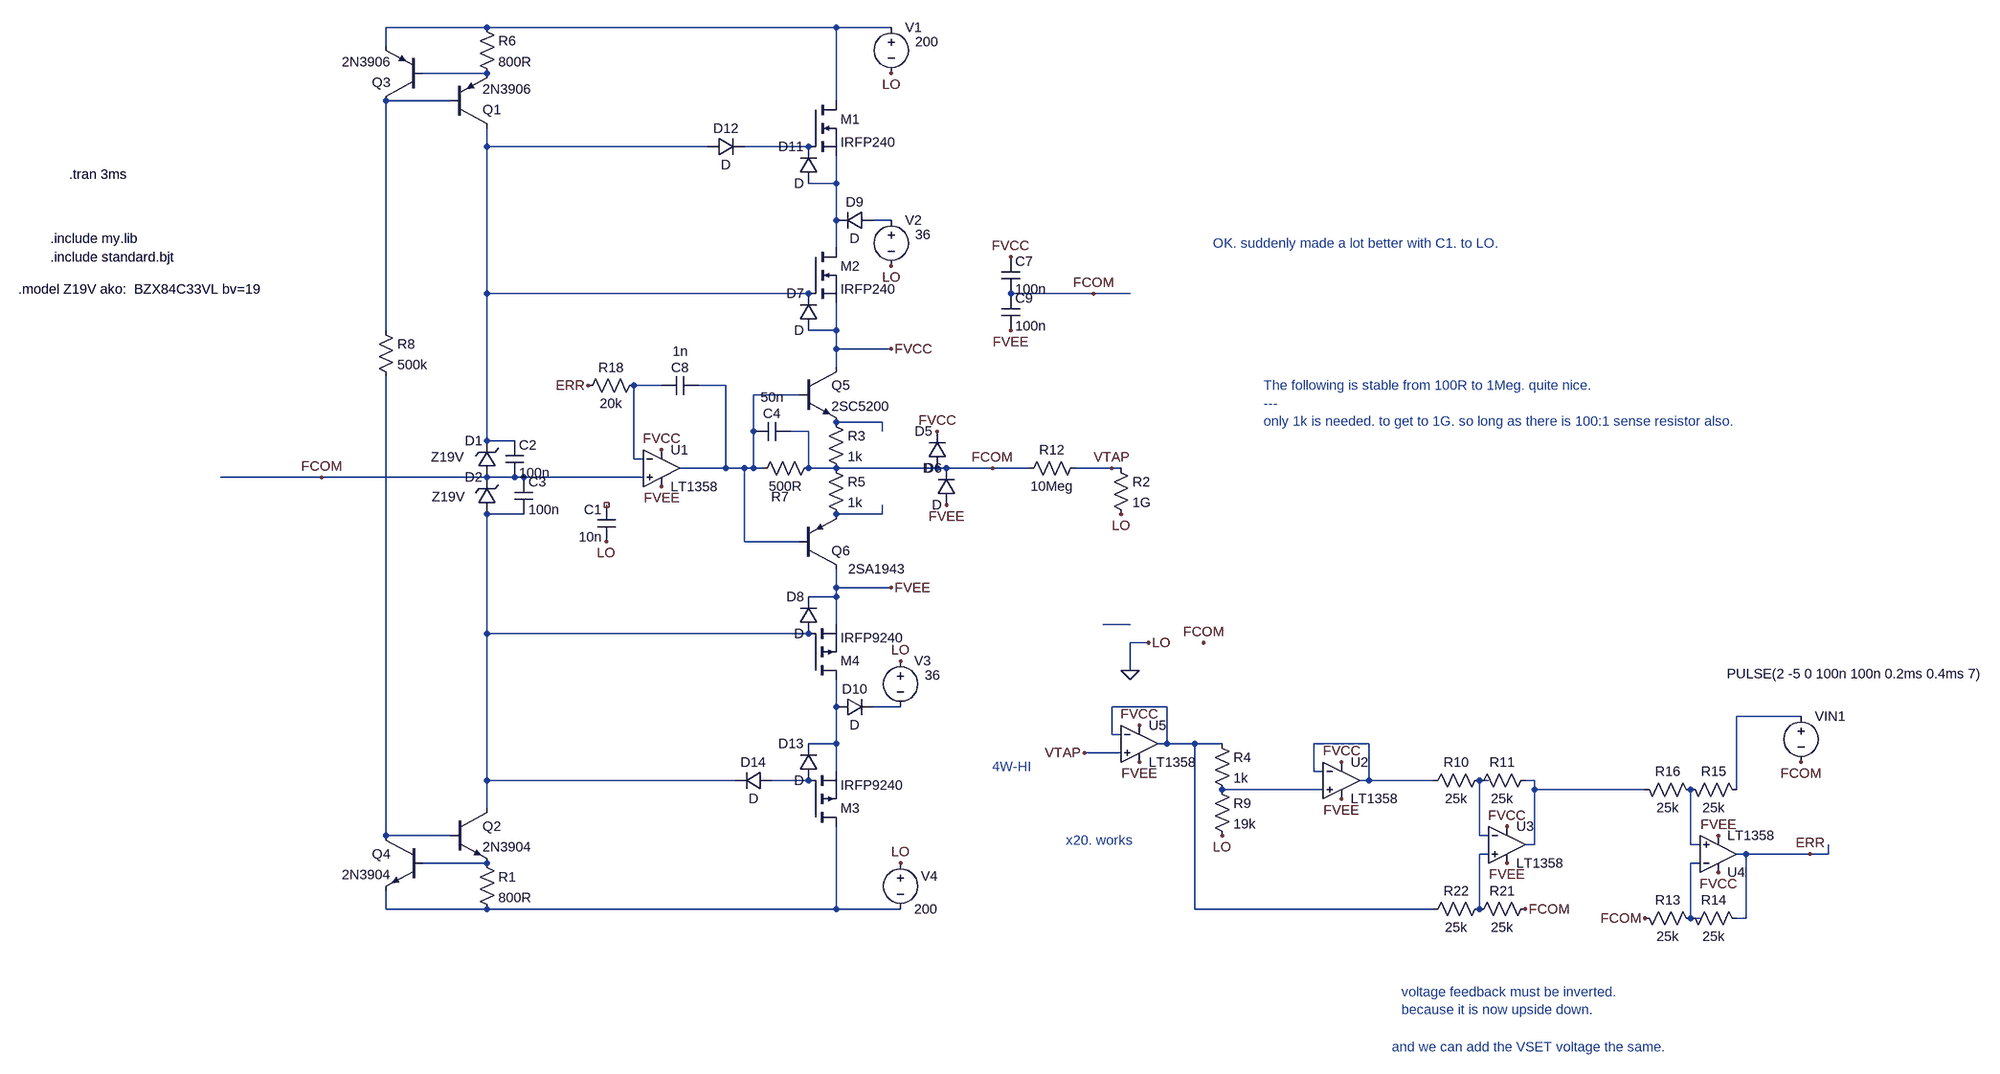
[diagram p0: schematic Draft17.asc]
Draft17.asc, the LTspice schematic file:
Version 4
SHEET 1 3524 1344
WIRE 624 -544 448 -544
WIRE 1232 -544 624 -544
WIRE 1328 -544 1232 -544
WIRE 448 -512 448 -544
WIRE 624 -464 512 -464
WIRE 560 -416 448 -416
WIRE 1232 -416 1232 -544
WIRE 624 -336 624 -368
WIRE 1008 -336 624 -336
WIRE 1184 -336 1072 -336
WIRE 1232 -272 1232 -320
WIRE 1232 -272 1184 -272
WIRE 1232 -208 1232 -272
WIRE 1328 -208 1296 -208
WIRE 1232 -160 1232 -208
WIRE 624 -80 624 -336
WIRE 1184 -80 624 -80
WIRE 1680 -80 1536 -80
WIRE 1744 -80 1680 -80
WIRE 448 -16 448 -416
WIRE 1232 -16 1232 -64
WIRE 1232 -16 1184 -16
WIRE 1232 16 1232 -16
WIRE 1328 16 1232 16
WIRE 1232 48 1232 16
WIRE 928 80 880 80
WIRE 1040 80 992 80
WIRE 1168 96 1088 96
WIRE 1312 144 1232 144
WIRE 1088 160 1088 96
WIRE 1184 160 1152 160
WIRE 1312 160 1312 144
WIRE 624 176 624 -80
WIRE 672 176 624 176
WIRE 880 208 880 80
WIRE 896 208 880 208
WIRE 1040 224 1040 80
WIRE 1040 224 960 224
WIRE 1072 224 1040 224
WIRE 1088 224 1088 160
WIRE 1088 224 1072 224
WIRE 1104 224 1088 224
WIRE 1184 224 1184 160
WIRE 1232 224 1184 224
WIRE 1408 224 1232 224
WIRE 1424 224 1408 224
WIRE 1504 224 1424 224
WIRE 1568 224 1504 224
WIRE 1712 224 1648 224
WIRE 1728 224 1712 224
WIRE 336 240 160 240
WIRE 624 240 336 240
WIRE 672 240 624 240
WIRE 688 240 672 240
WIRE 896 240 688 240
WIRE 688 304 624 304
WIRE 1312 304 1312 288
WIRE 1312 304 1232 304
WIRE 1072 352 1072 224
WIRE 1168 352 1072 352
WIRE 1232 432 1232 400
WIRE 1328 432 1232 432
WIRE 1232 448 1232 432
WIRE 1232 448 1184 448
WIRE 1232 496 1232 448
WIRE 1744 496 1696 496
WIRE 624 512 624 304
WIRE 1184 512 624 512
WIRE 1776 528 1744 528
WIRE 1744 576 1744 528
WIRE 1232 640 1232 592
WIRE 1344 640 1296 640
WIRE 1808 640 1712 640
WIRE 2912 656 2800 656
WIRE 1712 688 1712 640
WIRE 1728 688 1712 688
WIRE 1232 704 1232 640
WIRE 1232 704 1184 704
WIRE 1808 704 1808 640
WIRE 1808 704 1792 704
WIRE 1856 704 1808 704
WIRE 1904 704 1856 704
WIRE 2160 704 2064 704
WIRE 1728 720 1664 720
WIRE 1232 752 1232 704
WIRE 2064 752 2064 704
WIRE 2080 752 2064 752
WIRE 624 768 624 512
WIRE 1056 768 624 768
WIRE 1184 768 1120 768
WIRE 2160 768 2160 704
WIRE 2160 768 2144 768
WIRE 2272 768 2160 768
WIRE 2368 768 2352 768
WIRE 2448 768 2432 768
WIRE 2080 784 1904 784
WIRE 2448 784 2448 768
WIRE 2640 784 2448 784
WIRE 2800 784 2800 656
WIRE 624 816 624 768
WIRE 448 864 448 64
WIRE 560 864 448 864
WIRE 2352 864 2352 768
WIRE 2368 864 2352 864
WIRE 2448 880 2448 784
WIRE 2448 880 2432 880
WIRE 2720 880 2720 784
WIRE 2736 880 2720 880
WIRE 2368 896 2352 896
WIRE 2816 896 2800 896
WIRE 2928 896 2816 896
WIRE 2960 896 2960 880
WIRE 2960 896 2928 896
WIRE 624 912 512 912
WIRE 2736 912 2720 912
WIRE 448 992 448 960
WIRE 624 992 448 992
WIRE 1232 992 1232 848
WIRE 1232 992 624 992
WIRE 1344 992 1232 992
WIRE 1856 992 1856 704
WIRE 2272 992 1856 992
WIRE 2352 992 2352 896
WIRE 2720 1008 2720 912
WIRE 2736 1008 2720 1008
WIRE 2816 1008 2816 896
WIRE 2816 1008 2800 1008
FLAG 1328 16 FVCC
FLAG 1328 432 FVEE
FLAG 1536 -144 FVCC
FLAG 1536 -16 FVEE
FLAG 1408 160 FVCC
FLAG 1424 288 FVEE
FLAG 928 192 FVCC
FLAG 928 256 FVEE
FLAG 1504 224 FCOM
FLAG 2112 736 FVCC
FLAG 2112 800 FVEE
FLAG 1680 -80 FCOM
FLAG 2400 848 FVCC
FLAG 2400 912 FVEE
FLAG 2432 992 FCOM
FLAG 336 240 FCOM
FLAG 2928 896 ERR
FLAG 800 80 ERR
FLAG 2912 736 FCOM
FLAG 1712 224 VTAP
FLAG 1664 720 VTAP
FLAG 1344 912 LO
FLAG 1344 560 LO
FLAG 1328 -128 LO
FLAG 1328 -464 LO
FLAG 1904 864 LO
FLAG 1728 304 LO
FLAG 1776 528 LO
FLAG 832 352 LO
FLAG 2768 928 FVCC
FLAG 2768 864 FVEE
FLAG 2640 1008 FCOM
FLAG 1744 576 0
FLAG 1872 528 FCOM
FLAG 1760 672 FVCC
FLAG 1760 736 FVEE
SYMBOL pnp 560 -368 M180
SYMATTR InstName Q1
SYMATTR Value 2N3906
SYMBOL pnp 512 -416 R180
SYMATTR InstName Q3
SYMATTR Value 2N3906
SYMBOL res 608 -560 R0
SYMATTR InstName R6
SYMATTR Value 800R
SYMBOL voltage 1328 -560 R0
WINDOW 123 0 0 Left 0
WINDOW 39 0 0 Left 0
WINDOW 3 42 41 Left 2
SYMATTR Value 200
SYMATTR InstName V1
SYMBOL voltage 1344 896 R0
WINDOW 123 0 0 Left 0
WINDOW 39 0 0 Left 0
WINDOW 0 36 39 Left 2
SYMATTR InstName V4
SYMATTR Value 200
SYMBOL res 432 -32 R0
SYMATTR InstName R8
SYMATTR Value 500k
SYMBOL zener 640 240 R180
WINDOW 0 24 64 Left 2
WINDOW 3 56 35 Left 2
SYMATTR InstName D1
SYMATTR Value Z19V
SYMBOL zener 640 304 R180
WINDOW 0 24 64 Left 2
WINDOW 3 54 30 Left 2
SYMATTR InstName D2
SYMATTR Value Z19V
SYMBOL npn 560 816 R0
SYMATTR InstName Q2
SYMATTR Value 2N3904
SYMBOL res 608 896 R0
SYMATTR InstName R1
SYMATTR Value 800R
SYMBOL npn 512 864 M0
SYMATTR InstName Q4
SYMATTR Value 2N3904
SYMBOL npn 1168 48 R0
SYMATTR InstName Q5
SYMATTR Value 2SC5200
SYMBOL pnp 1168 400 M180
WINDOW 3 85 0 Left 2
SYMATTR Value 2SA1943
SYMATTR InstName Q6
SYMBOL res 1216 128 R0
SYMATTR InstName R3
SYMATTR Value 1k
SYMBOL res 1216 208 R0
SYMATTR InstName R5
SYMATTR Value 1k
SYMBOL res 1200 208 R90
WINDOW 0 81 66 VBottom 2
WINDOW 3 32 56 VTop 2
SYMATTR InstName R7
SYMATTR Value 500R
SYMBOL nmos 1184 -160 R0
SYMATTR InstName M2
SYMATTR Value IRFP240
SYMBOL pmos 1184 592 M180
SYMATTR InstName M4
SYMATTR Value IRFP9240
SYMBOL cap 656 176 R0
SYMATTR InstName C2
SYMATTR Value 100n
SYMBOL cap 672 240 R0
SYMATTR InstName C3
SYMATTR Value 100n
SYMBOL res 1712 208 R0
SYMATTR InstName R2
SYMATTR Value 1G
SYMBOL cap 1520 -144 R0
SYMATTR InstName C7
SYMATTR Value 100n
SYMBOL diode 1424 224 R180
WINDOW 0 24 64 Left 2
WINDOW 3 24 0 Left 2
SYMATTR InstName D5
SYMBOL diode 1440 288 R180
WINDOW 0 24 64 Left 2
WINDOW 3 24 0 Left 2
SYMATTR InstName D6
SYMBOL diode 1200 -16 R180
WINDOW 0 24 64 Left 2
WINDOW 3 24 0 Left 2
SYMATTR InstName D7
SYMBOL diode 1200 512 R180
WINDOW 0 24 64 Left 2
WINDOW 3 24 0 Left 2
SYMATTR InstName D8
SYMBOL diode 1296 -224 R90
WINDOW 0 0 32 VBottom 2
WINDOW 3 32 32 VTop 2
SYMATTR InstName D9
SYMBOL voltage 1328 -224 R0
WINDOW 123 0 0 Left 0
WINDOW 39 0 0 Left 0
WINDOW 3 42 41 Left 2
SYMATTR Value 36
SYMATTR InstName V2
SYMBOL diode 1232 656 R270
WINDOW 0 32 32 VTop 2
WINDOW 3 0 32 VBottom 2
SYMATTR InstName D10
SYMBOL voltage 1344 544 R0
WINDOW 123 0 0 Left 0
WINDOW 39 0 0 Left 0
WINDOW 3 42 41 Left 2
SYMATTR Value 36
SYMATTR InstName V3
SYMBOL nmos 1184 -416 R0
SYMATTR InstName M1
SYMATTR Value IRFP240
SYMBOL diode 1200 -272 R180
WINDOW 0 24 64 Left 2
WINDOW 3 24 0 Left 2
SYMATTR InstName D11
SYMBOL diode 1008 -320 R270
WINDOW 0 32 32 VTop 2
WINDOW 3 0 32 VBottom 2
SYMATTR InstName D12
SYMBOL pmos 1184 848 M180
SYMATTR InstName M3
SYMATTR Value IRFP9240
SYMBOL diode 1200 768 R180
WINDOW 0 24 64 Left 2
WINDOW 3 24 0 Left 2
SYMATTR InstName D13
SYMBOL diode 1120 752 R90
WINDOW 0 0 32 VBottom 2
WINDOW 3 32 32 VTop 2
SYMATTR InstName D14
SYMBOL res 1888 688 R0
SYMATTR InstName R4
SYMATTR Value 1k
SYMBOL res 1888 768 R0
SYMATTR InstName R9
SYMATTR Value 19k
SYMBOL cap 1520 -80 R0
SYMATTR InstName C9
SYMATTR Value 100n
SYMBOL res 2368 752 R90
WINDOW 0 0 56 VBottom 2
WINDOW 3 32 56 VTop 2
SYMATTR InstName R10
SYMATTR Value 25k
SYMBOL res 2448 752 R90
WINDOW 0 0 56 VBottom 2
WINDOW 3 32 56 VTop 2
SYMATTR InstName R11
SYMATTR Value 25k
SYMBOL cap 992 64 R90
WINDOW 0 0 32 VBottom 2
WINDOW 3 -59 31 VTop 2
SYMATTR InstName C8
SYMATTR Value 1n
SYMBOL res 896 64 R90
WINDOW 0 0 56 VBottom 2
WINDOW 3 32 56 VTop 2
SYMATTR InstName R18
SYMATTR Value 20k
SYMBOL res 2448 976 R90
WINDOW 0 0 56 VBottom 2
WINDOW 3 32 56 VTop 2
SYMATTR InstName R21
SYMATTR Value 25k
SYMBOL res 2368 976 R90
WINDOW 0 0 56 VBottom 2
WINDOW 3 32 56 VTop 2
SYMATTR InstName R22
SYMATTR Value 25k
SYMBOL voltage 2912 640 R0
WINDOW 123 0 0 Left 0
WINDOW 39 0 0 Left 0
WINDOW 3 -129 -58 Left 2
SYMATTR Value PULSE(2 -5 0 100n 100n 0.2ms 0.4ms 7)
SYMATTR InstName VIN1
SYMBOL OpAmps\\LT1358 928 160 R0
SYMATTR InstName U1
SYMBOL OpAmps\\LT1358 2112 704 R0
SYMATTR InstName U2
SYMBOL OpAmps\\LT1358 2400 816 R0
SYMATTR InstName U3
SYMBOL res 1664 208 R90
WINDOW 0 0 56 VBottom 2
WINDOW 3 32 56 VTop 2
SYMATTR InstName R12
SYMATTR Value 10Meg
SYMBOL res 2736 1024 M270
WINDOW 0 32 56 VTop 2
WINDOW 3 0 56 VBottom 2
SYMATTR InstName R13
SYMATTR Value 25k
SYMBOL res 2816 1024 M270
WINDOW 0 32 56 VTop 2
WINDOW 3 0 56 VBottom 2
SYMATTR InstName R14
SYMATTR Value 25k
SYMBOL res 2816 800 M270
WINDOW 0 32 56 VTop 2
WINDOW 3 0 56 VBottom 2
SYMATTR InstName R15
SYMATTR Value 25k
SYMBOL res 2736 800 M270
WINDOW 0 32 56 VTop 2
WINDOW 3 0 56 VBottom 2
SYMATTR InstName R16
SYMATTR Value 25k
SYMBOL OpAmps\\LT1358 2768 960 M180
SYMATTR InstName U4
SYMBOL cap 848 352 R180
WINDOW 0 24 56 Left 2
WINDOW 3 24 8 Left 2
SYMATTR InstName C1
SYMATTR Value 10n
SYMBOL OpAmps\\LT1358 1760 640 R0
SYMATTR InstName U5
SYMBOL cap 1152 144 R90
WINDOW 0 0 32 VBottom 2
WINDOW 3 -59 31 VTop 2
SYMATTR InstName C4
SYMATTR Value 50n
TEXT -104 -288 Left 2 !.tran 3ms
TEXT -136 -176 Left 2 !.include my.lib
TEXT -192 -88 Left 2 !.model Z19V ako:  BZX84C33VL bv=19
TEXT -136 -144 Left 2 !.include standard.bjt
TEXT 1504 744 Left 2 ;4W-HI
TEXT 2216 1136 Left 2 ;voltage feedback must be inverted.\nbecause it is now upside down.
TEXT 2200 1232 Left 2 ;and we can add the VSET voltage the same.
TEXT 1632 872 Left 2 ;x20. works
TEXT 1888 -168 Left 2 ;OK. suddenly made a lot better with C1. to LO.
TEXT 1976 80 Left 2 ;The following is stable from 100R to 1Meg. quite nice.\n---\nonly 1k is needed. to get to 1G. so long as there is 100:1 sense resistor also.

The netlist it stands for:
* Draft17.asc
Q1 N004 N003 N002 0 2N3906
Q3 N003 N002 N001 0 2N3906
R6 N001 N002 800R
V1 N001 0 200
V4 0 N028 200
R8 N003 N023 500k
D1 FCOM N004 Z19V
D2 N011 FCOM Z19V
Q2 N011 N023 N026 0 2N3904
R1 N026 N028 800R
Q4 N023 N026 N028 0 2N3904
Q5 FVCC N009 N010 0 2SC5200
Q6 FVEE N009 N012 0 2SA1943
R3 N010 FCOM 1k
R5 FCOM N012 1k
R7 FCOM N009 500R
M2 N006 N004 FVCC FVCC IRFP240
M4 N014 N011 FVEE FVEE IRFP9240
C2 N004 FCOM 100n
C3 FCOM N011 100n
R2 VTAP 0 1G
C7 FVCC FCOM 100n
D5 FCOM FVCC D
D6 FVEE FCOM D
D7 FVCC N004 D
D8 N011 FVEE D
D9 N007 N006 D
V2 N007 0 36
D10 N014 N015 D
V3 0 N015 36
M1 N001 N005 N006 N006 IRFP240
D11 N006 N005 D
D12 N004 N005 D
M3 N028 N019 N014 N014 IRFP9240
D13 N019 N014 D
D14 N019 N011 D
R4 N016 N022 1k
R9 N022 0 19k
C9 FCOM FVEE 100n
R10 N020 N018 25k
R11 N021 N020 25k
C8 N009 N008 1n
R18 N008 ERR 20k
R21 FCOM N025 25k
R22 N025 N016 25k
VIN1 N017 FCOM PULSE(2 -5 0 100n 100n 0.2ms 0.4ms 7)
XU1 FCOM N008 FVCC FVEE N009 LT1357  ; LT1358, pins In+ In- V+ V- OUT
XU2 N022 N018 FVCC FVEE N018 LT1357  ; LT1358, pins In+ In- V+ V- OUT
XU3 N025 N020 FVCC FVEE N021 LT1357  ; LT1358, pins In+ In- V+ V- OUT
R12 VTAP FCOM 10Meg
R13 N027 FCOM 25k
R14 ERR N027 25k
R15 N017 N024 25k
R16 N024 N021 25k
XU4 N024 N027 FVCC FVEE ERR LT1357  ; LT1358, pins In+ In- V+ V- OUT
C1 0 NC_01 10n
XU5 VTAP N016 FVCC FVEE N016 LT1357  ; LT1358, pins In+ In- V+ V- OUT
C4 FCOM N009 50n
.model D D
.lib standard.dio
.model NPN NPN
.model PNP PNP
.lib standard.bjt
.model NMOS NMOS
.model PMOS PMOS
.lib standard.mos
.tran 3ms
.include my.lib
.model Z19V ako:  BZX84C33VL bv=19
.include standard.bjt
* 4W-HI
* voltage feedback must be inverted.
* because it is now upside down.
* and we can add the VSET voltage the same.
* x20. works
* OK. suddenly made a lot better with C1. to LO.
* The following is stable from 100R to 1Meg. quite nice.
* ---
* only 1k is needed. to get to 1G. so long as there is 100:1 sense resistor also.
.lib LTC.lib
.backanno
.end